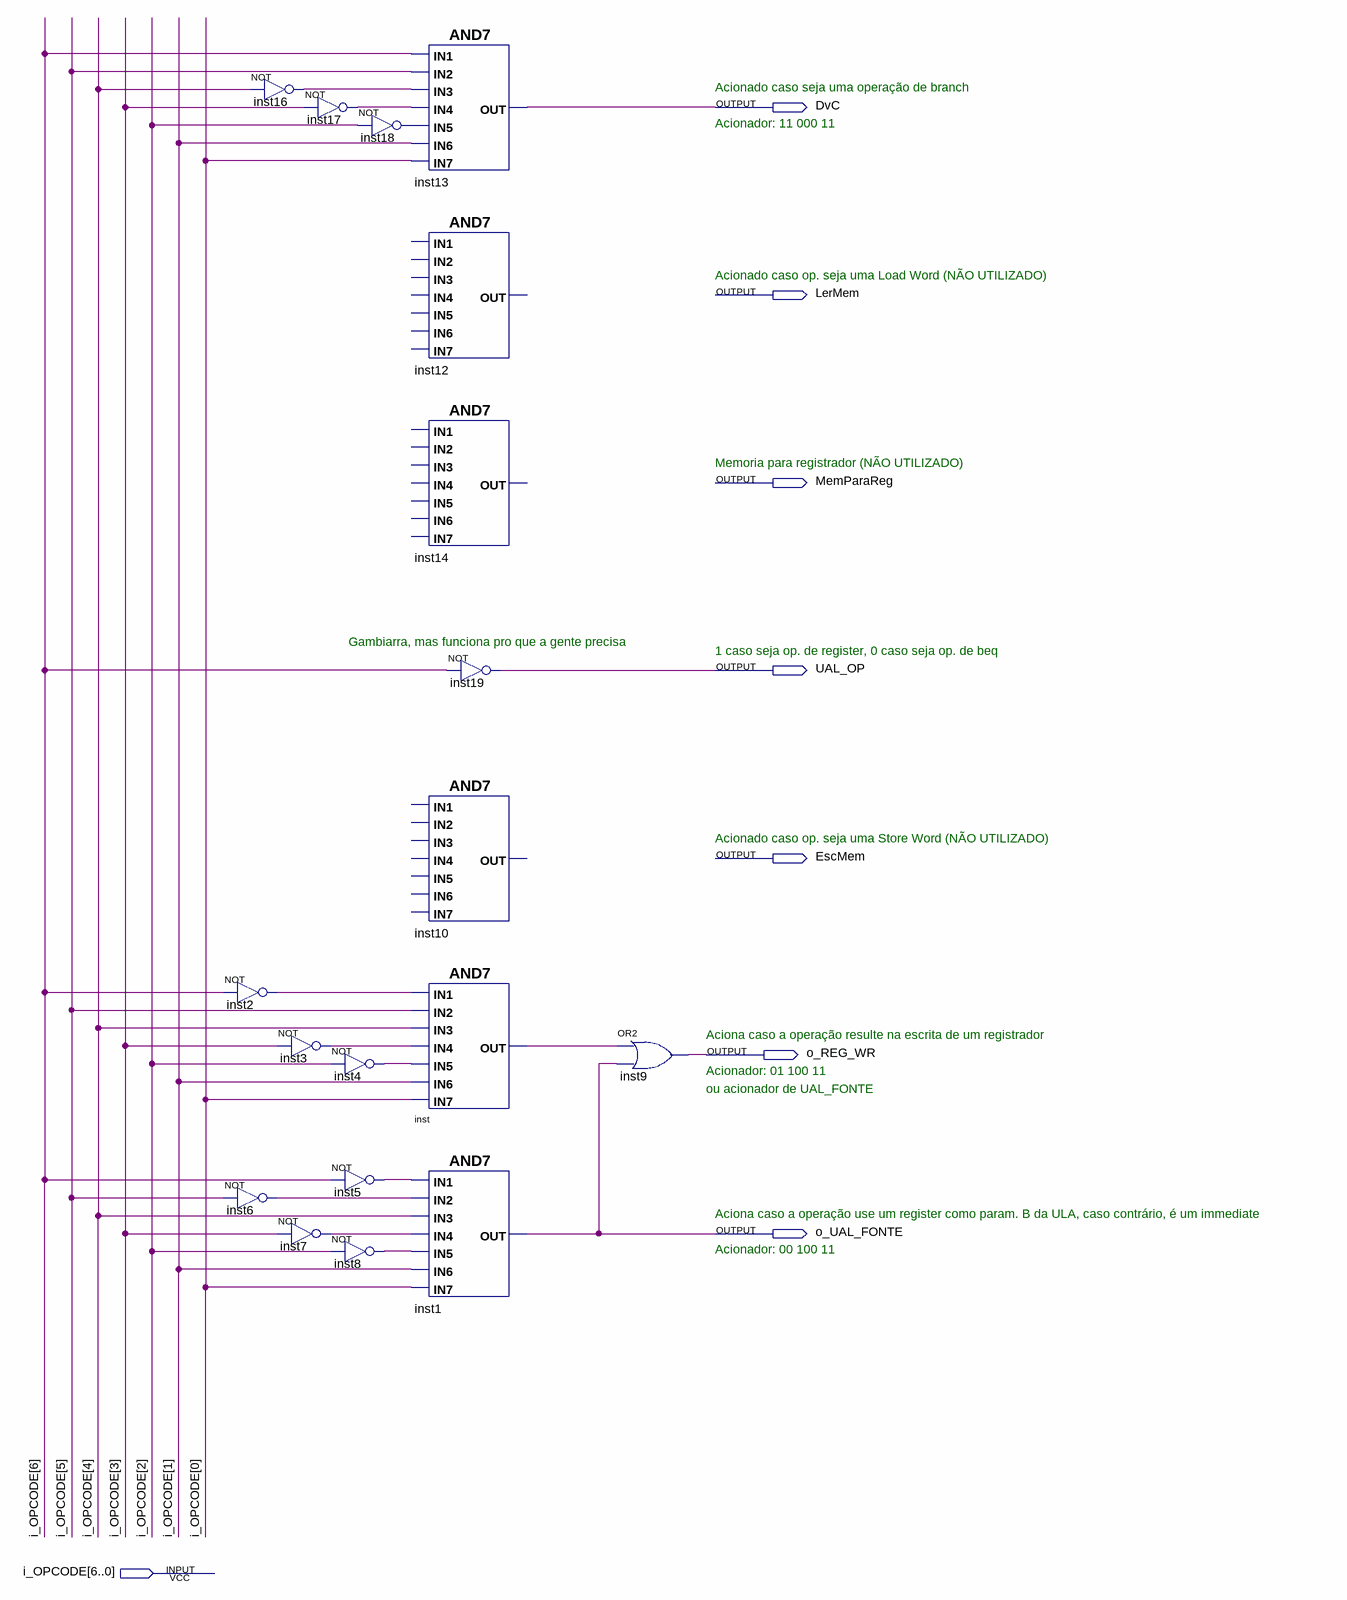
[diagram p0: schematic sheet]
// Quartus schematic controle.bdf as structural Verilog: 18 symbols, 8 pins
module controle (
  input  [6:0] i_OPCODE,
  output DvC,
  output LerMem,
  output MemParaReg,
  output UAL_OP,
  output EscMem,
  output o_REG_WR,
  output o_UAL_FONTE
);

  wire inst2_out, inst3_out, inst4_out, inst5_out, inst6_out, inst7_out, inst8_out, inst16_out, inst17_out,
       inst18_out, inst_out;

  not inst2 (inst2_out, i_OPCODE[6]);
  not inst6 (inst6_out, i_OPCODE[5]);
  not inst16 (inst16_out, i_OPCODE[4]);
  not inst17 (inst17_out, i_OPCODE[3]);
  not inst3 (inst3_out, i_OPCODE[3]);
  not inst7 (inst7_out, i_OPCODE[3]);
  not inst18 (inst18_out, i_OPCODE[2]);
  not inst4 (inst4_out, i_OPCODE[2]);
  not inst5 (inst5_out, i_OPCODE[6]);
  not inst8 (inst8_out, i_OPCODE[2]);
  and inst13 (DvC, i_OPCODE[6], i_OPCODE[5], inst16_out, inst17_out, inst18_out, i_OPCODE[1], i_OPCODE[0]);
  // AND7 inst12 is placed but not wired
  // AND7 inst14 is placed but not wired
  not inst19 (UAL_OP, i_OPCODE[6]);
  // AND7 inst10 is placed but not wired
  and inst (inst_out, inst2_out, i_OPCODE[5], i_OPCODE[4], inst3_out, inst4_out, i_OPCODE[1], i_OPCODE[0]);
  and inst1 (o_UAL_FONTE, inst5_out, inst6_out, i_OPCODE[4], inst7_out, inst8_out, i_OPCODE[1], i_OPCODE[0]);
  or inst9 (o_REG_WR, inst_out, o_UAL_FONTE);

  // Notes on the sheet:
  //   Acionado caso seja uma operação de branch
  //   Acionador: 11 000 11
  //   Acionado caso op. seja uma Load Word (NÃO UTILIZADO)
  //   Memoria para registrador (NÃO UTILIZADO)
  //   Gambiarra, mas funciona pro que a gente precisa
  //   1 caso seja op. de register, 0 caso seja op. de beq
  //   Acionado caso op. seja uma Store Word (NÃO UTILIZADO)
  //   Aciona caso a operação resulte na escrita de um registrador
  //   Acionador: 01 100 11
  //   ou acionador de UAL_FONTE
  //   Aciona caso a operação use um register como param. B da ULA, caso contrário, é um immediate
  //   Acionador: 00 100 11
endmodule
